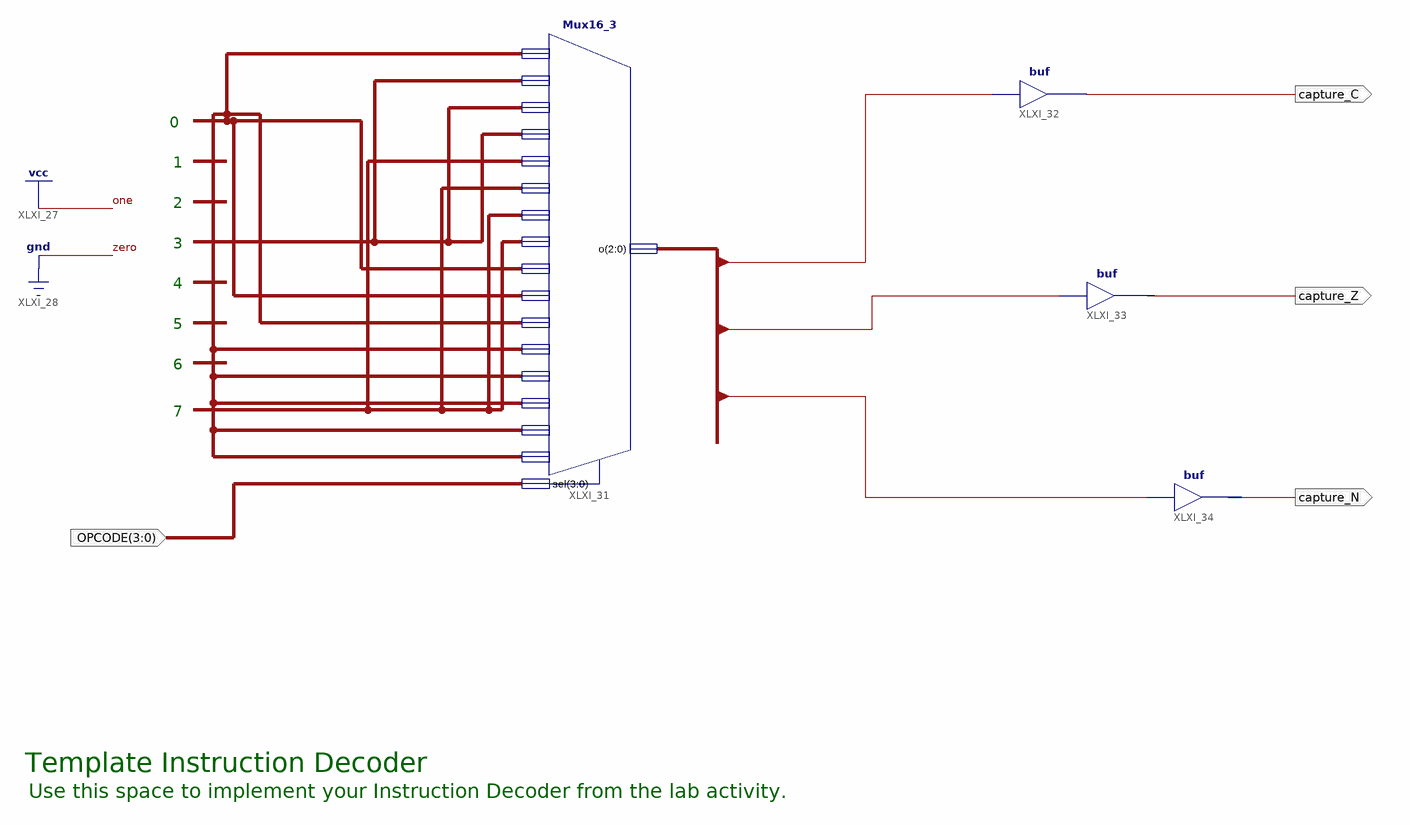
[diagram p0: schematic sheet 1]
// Xilinx ISE schematic Instruction_Decoder.sch (spartan3e) as structural Verilog: 4 symbols, 4 ports
module Instruction_Decoder (
  input  [3:0] OPCODE,
  output capture_C,
  output capture_Z,
  output capture_N
);

  wire [2:0] O;

  Mux16_3 XLXI_31 (
    .i0(3'b000), .i1(3'b011), .i2(3'b011), .i3(3'b011), .i4(3'b111), .i5(3'b111), .i6(3'b111), .i7(3'b111),
    .i8(3'b000), .i9(3'b000), .i10(3'b000), .i11(3'b000), .i12(3'b000), .i13(3'b000), .i14(3'b000),
    .i15(3'b000), .sel(OPCODE), .o(O));
  buf XLXI_32 (capture_C, O[2]);
  buf XLXI_33 (capture_Z, O[1]);
  buf XLXI_34 (capture_N, O[0]);

  // Notes on the sheet:
  //   0
  //   1
  //   2
  //   3
  //   4
  //   5
  //   6
  //   7
  //   Template Instruction Decoder
  //   Use this space to implement your Instruction Decoder from the lab activity.
endmodule
